# Altium schematic sheet Sheet4.SchDoc
size A4
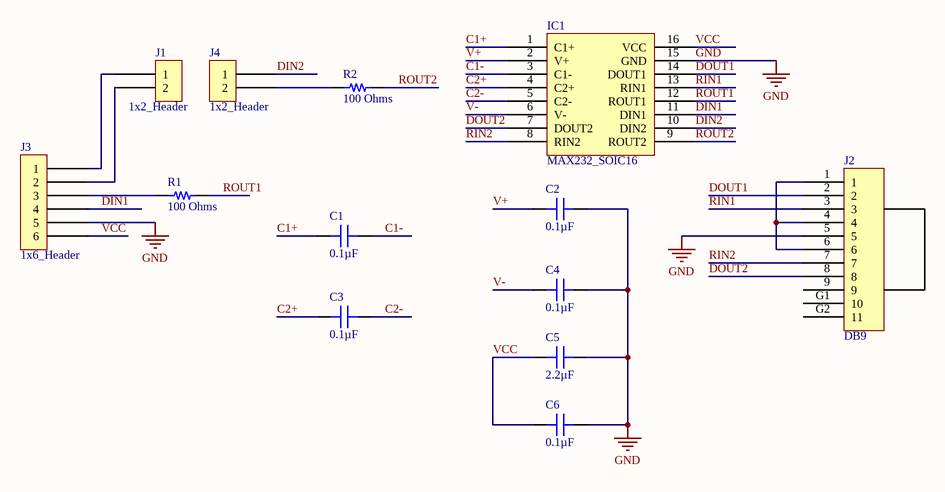
[diagram p0: Sheet4.SchDoc]

## Parts
C1  0.1µF  [CAP 1206_3216 - 1.8MM]
C2  0.1µF  [CAP 1206_3216 - 1.8MM]
C3  0.1µF  [CAP 1206_3216 - 1.8MM]
C4  0.1µF  [CAP 1206_3216 - 1.8MM]
C5  2.2µF  [CAP 1206_3216 - 1.8MM]
C6  0.1µF  [CAP 1206_3216 - 1.8MM]
IC1  MAX232_SOIC16  [SOIC127P1030X265-16N]
J1  1x2_Header  [1x2_Header]
J2  DB9  [DB9]
J3  1x6_Header  [1x6_Header]
J4  1x2_Header  [1x2_Header]
R1  100 Ohms  [RES 2512_6432]
R2  100 Ohms  [RES 2512_6432]

## Nets
GND: C2.1 C4.2 C5.2 C6.2 IC1.15(GND) J2.5 J3.5
C1+: C1.1 IC1.1(C1+)
C1-: C1.2 IC1.3(C1-)
C2+: C3.2 IC1.4(C2+)
C2-: C3.1 IC1.5(C2-)
DIN1: IC1.11(DIN1) J3.4
DIN2: IC1.10(DIN2) J4.1
DOUT1: IC1.14(DOUT1) J2.2
DOUT2: IC1.7(DOUT2) J2.8
RIN1: IC1.13(RIN1) J2.3
RIN2: IC1.8(RIN2) J2.7
ROUT1: IC1.12(ROUT1) R1.2
ROUT2: IC1.9(ROUT2) R2.2
V+: C2.2 IC1.2(V+)
V-: C4.1 IC1.6(V-)
VCC: C5.1 C6.1 IC1.16(VCC) J3.6
NetJ1_1: J1.1 J3.1
NetJ1_2: J1.2 J3.2
NetJ2_1: J2.1 J2.4 J2.6
NetJ3_3: J3.3 R1.1
NetJ4_2: J4.2 R2.1

Not connected (* = marked no-connect by the designer): J2 9 G1(10) G2(11)

## Library data of the parts
C1-C4 C6 = C3216C0G2A104J160AC: CAP CER 0.1UF 100V C0G 1206; Manufacturer: TDK Corporation; Temperature Coefficient: C0G, NP0; Tolerance: ±5%; Part Number: C3216C0G2A104J160AC; Value: 0.1µF; Applications: General Purpose; Capacitance: 0.1µF; ComponentLink1Description: Datasheet; ComponentLink1URL: https://product.tdk.com/info/en/catalog/datasheets/mlcc_commercial_midvoltage_en.pdf?ref_disty=digikey; ComponentLink2Description: DigiKey Link; ComponentLink2URL: http://digikey.com/product-detail/en/tdk-corporation/C3216C0G2A104J160AC/445-172677-1-ND/5023403; Device Package: 1206 (3216 Metric); Features: Low ESL; LastUpdated: 2.09.2020 01:05:21; Lifecycle Status: Active; Minimum Order: 1; Mounting Type: Surface Mount, MLCC; Operating Temperature: -55°C ~ 125°C; Package / Case: 1206 (3216 Metric); Packaging: TapeAndReel; PartId: 22827; Part Status: Active; Price: 0.26; Series: C; Size / Dimension: 0.126" L x 0.063" W (3.20mm x 1.60mm); Supplier 1: DigiKey; Supplier Part Number 1: 445-172677-1-ND; Thickness (Max): 0.071" (1.80mm); Voltage - Rated: 100V
C5 = CGA5L3X8R1E225M160AB: CAP CER 2.2UF 25V X8R 1206; Manufacturer: TDK Corporation; Tolerance: ±20%; Part Number: CGA5L3X8R1E225M160AB; Value: 2.2µF; Applications: Automotive; Capacitance: 2.2µF; ComponentLink1Description: Datasheet; ComponentLink1URL: https://product.tdk.com/info/en/catalog/datasheets/mlcc_automotive_hightemp_en.pdf?ref_disty=digikey; ComponentLink2Description: DigiKey Link; ComponentLink2URL: http://digikey.com/product-detail/en/tdk-corporation/CGA5L3X8R1E225M160AB/445-12992-1-ND/3954658; Device Package: 1206 (3216 Metric); Features: High Temperature; LastUpdated: 2.09.2020 01:05:21; Lifecycle Status: Active; Minimum Order: 1; Mounting Type: Surface Mount, MLCC; Operating Temperature: -55°C ~ 150°C; Package / Case: 1206 (3216 Metric); Packaging: TapeAndReel; PartId: 22799; Part Status: Active; Price: 0.20; Ratings: AEC-Q200; Series: CGA; Size / Dimension: 0.126" L x 0.063" W (3.20mm x 1.60mm); Supplier 1: DigiKey; Supplier Part Number 1: 445-12992-1-ND; Temperature Coefficient: X8R; Thickness (Max): 0.071" (1.80mm); Voltage - Rated: 25V
R1 R2 = RC2512FK-07100RL: RES SMD 100 OHM 1% 1W 2512; Manufacturer: Yageo; Temperature Coefficient: ±100ppm/°C; Part Number: RC2512FK-07100RL; ComponentLink1Description: Datasheet; ComponentLink1URL: https://www.yageo.com/upload/media/product/productsearch/datasheet/rchip/PYu-RC_Group_51_RoHS_L_10.pdf; ComponentLink2Description: DigiKey Link; ComponentLink2URL: http://digikey.com/product-detail/en/yageo/RC2512FK-07100RL/YAG3387CT-ND/5962209; Composition: Thick Film; Device Package: 2512 (6432 Metric); Features: Moisture Resistant; Height - Seated (Max): 0.026" (0.65mm); LastUpdated: 2.09.2020 01:27:03; Lifecycle Status: Active; Minimum Order: 1; Number of Terminations: 2; Operating Temperature: -55°C ~ 155°C; Package / Case: 2512 (6432 Metric); Packaging: TapeAndReel; Part Status: Active; Power (Watts): 1W; Price: 0.05; Resistance: 100 Ohms; Series: RC; Size / Dimension: 0.250" L x 0.122" W (6.35mm x 3.10mm); Supplier 1: DigiKey; Supplier Part Number 1: YAG3387CT-ND; Supplier Device Package: 2512; Tolerance: ±1%; Value: 100 Ohms